# Altium schematic sheet Main.SchDoc
size A; SheetNumber: 1; SheetTotal: 4
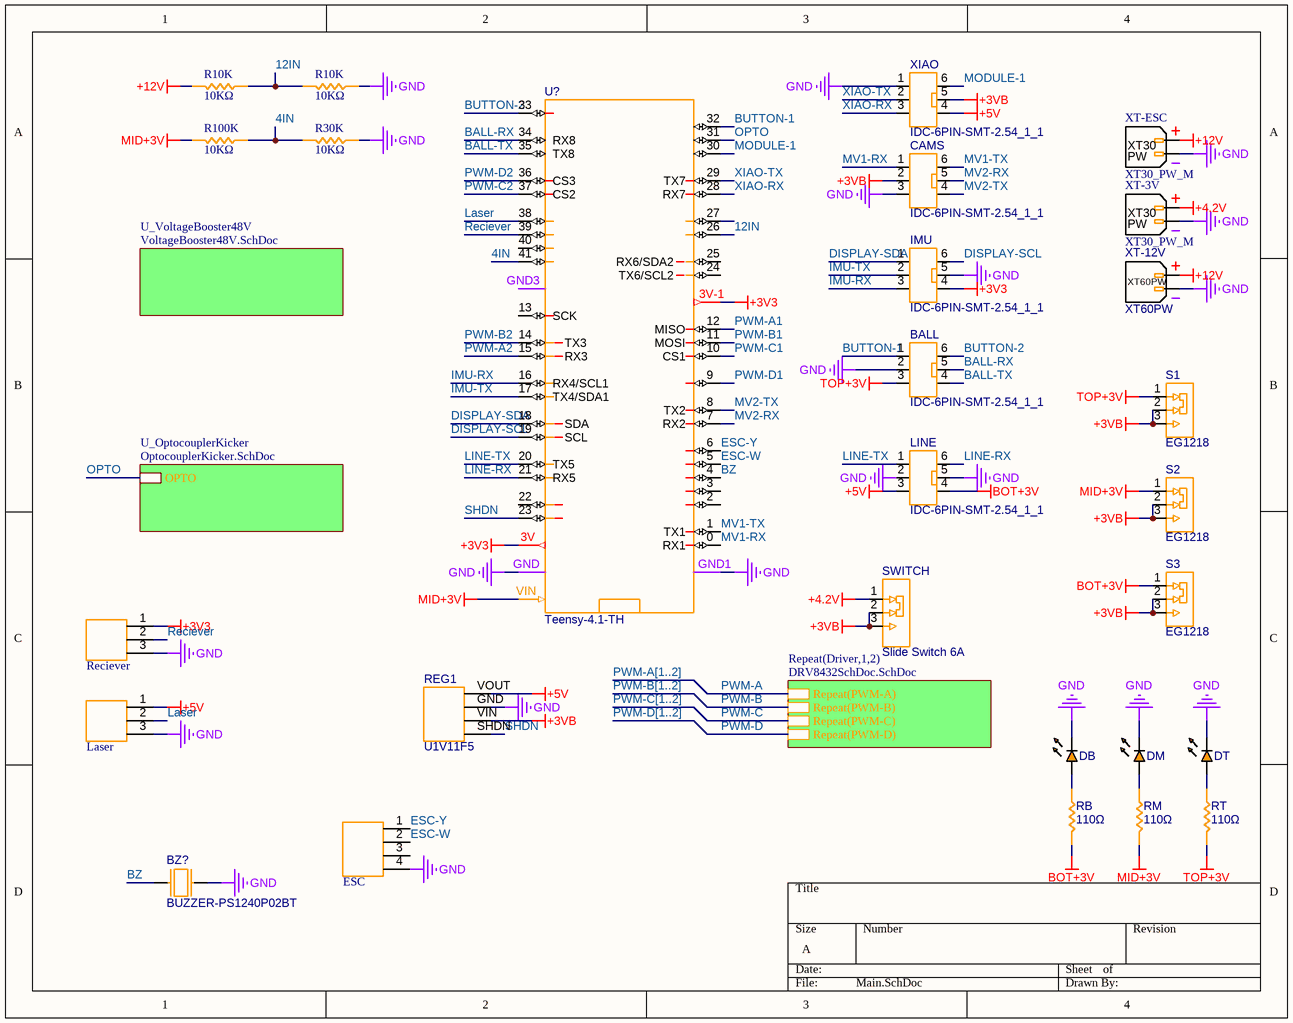
[diagram p0: Main.SchDoc]

## Parts
(Parts that share a designator on the sheet are numbered #1, #2 ... from top to bottom, then left to right.)
BALL  IDC-6PIN-SMT-2.54_1_1  [IDC-6PIN-SMT-2.54]
BZ?  BUZZER-PS1240P02BT  [BUZZER-PS1240P02BT]
CAMS  IDC-6PIN-SMT-2.54_1_1  [IDC-6PIN-SMT-2.54]
DB  LED_0603  [LED_0603]  (value not drawn)
DM  LED_0603  [LED_0603]  (value not drawn)
DT  LED_0603  [LED_0603]  (value not drawn)
ESC  4PIN  [4PIN]  (value not drawn)
IMU  IDC-6PIN-SMT-2.54_1_1  [IDC-6PIN-SMT-2.54]
Laser  3PIN  [3PIN]  (value not drawn)
LINE  IDC-6PIN-SMT-2.54_1_1  [IDC-6PIN-SMT-2.54]
R10K#1  10KΩ  [RES_0603]
R10K#2  10KΩ  [RES_0603]
R30K  10KΩ  [RES_0603]
R100K  10KΩ  [RES_0603]
RB  110Ω  [RES_0603]
Reciever  3PIN  [3PIN]  (value not drawn)
REG1  U1V11F5  [U1V11F5]
RM  110Ω  [RES_0603]
RT  110Ω  [RES_0603]
S1  EG1218  [EG1218]
S2  EG1218  [EG1218]
S3  EG1218  [EG1218]
SWITCH  Slide Switch 6A  [Slide Switch 6A]
U?  Teensy-4.1-TH  [Teensy-4.1-TH]
XIAO  IDC-6PIN-SMT-2.54_1_1  [IDC-6PIN-SMT-2.54]
XT-3V  XT30_PW_M  [XT30_PW_M]
XT-12V  XT60PW  [XT60PW]
XT-ESC  XT30_PW_M  [XT30_PW_M]

## Sub-sheets
Repeat(Driver,1,2) = DRV8432SchDoc.SchDoc: Repeat(PWM-A), Repeat(PWM-B), Repeat(PWM-C), Repeat(PWM-D)
U_OptocouplerKicker = OptocouplerKicker.SchDoc: OPTO
U_VoltageBooster48V = VoltageBooster48V.SchDoc: no entries

## Nets
+3V3: IMU.4 Reciever.1 U?.3V U?.3V-1
+3VB: CAMS.2 REG1.VIN S1.2(COM) S1.3(NO) S2.2(COM) S2.3(NO) S3.2(COM) S3.3(NO) SWITCH.2(COM) SWITCH.3(NO) XIAO.5
+4.2V: SWITCH.1(NC) XT-3V.P
+5V: Laser.1 LINE.3 REG1.VOUT XIAO.4
+12V: R10K#1.1 XT-12V.P XT-ESC.P
BOT+3V: LINE.4 RB.1 S3.1(NC)
GND: BALL.2 BZ?.2 CAMS.3 DB.C DM.C DT.C ESC.4 IMU.5 Laser.3 LINE.2 LINE.5 R10K#2.2 R30K.2 Reciever.3 REG1.GND U?.GND U?.GND1 XIAO.1 XT-3V.N XT-12V.N XT-ESC.N
MID+3V: R100K.1 RM.1 S2.1(NC) U?.VIN
TOP+3V: BALL.3 RT.1 S1.1(NC)
4IN: R30K.1 R100K.2 U?.41
12IN: R10K#1.2 R10K#2.1 U?.26
BALL-RX: BALL.5 U?.34(RX8)
BALL-TX: BALL.4 U?.35(TX8)
BUTTON-1: BALL.1 U?.32
BUTTON-2: BALL.6 U?.33
BZ: BZ?.1 U?.4
DISPLAY-SCL: IMU.6 U?.19(SCL)
DISPLAY-SDA: IMU.1 U?.18(SDA)
ESC-W: ESC.2 U?.5
ESC-Y: ESC.1 U?.6
IMU-RX: IMU.3 U?.16(RX4/SCL1)
IMU-TX: IMU.2 U?.17(TX4/SDA1)
Laser: Laser.2 U?.38
LINE-RX: LINE.6 U?.21(RX5)
LINE-TX: LINE.1 U?.20(TX5)
MODULE-1: U?.30 XIAO.6
MV1-RX: CAMS.1 U?.0(RX1)
MV1-TX: CAMS.6 U?.1(TX1)
MV2-RX: CAMS.5 U?.7(RX2)
MV2-TX: CAMS.4 U?.8(TX2)
OPTO: U?.31 ; sheet U_OptocouplerKicker/OPTO
PWM-A: sheet Repeat(Driver,1,2)/Repeat(PWM-A)
PWM-A1: U?.12(MISO)
PWM-A2: U?.15(RX3)
PWM-B: sheet Repeat(Driver,1,2)/Repeat(PWM-B)
PWM-B1: U?.11(MOSI)
PWM-B2: U?.14(TX3)
PWM-C: sheet Repeat(Driver,1,2)/Repeat(PWM-C)
PWM-C1: U?.10(CS1)
PWM-C2: U?.37(CS2)
PWM-D: sheet Repeat(Driver,1,2)/Repeat(PWM-D)
PWM-D1: U?.9
PWM-D2: U?.36(CS3)
Reciever: Reciever.2 U?.39
SHDN: REG1.SHDN U?.23
XIAO-RX: U?.28(RX7) XIAO.3
XIAO-TX: U?.29(TX7) XIAO.2
NetDB_A: DB.A RB.2
NetDM_A: DM.A RM.2
NetDT_A: DT.A RT.2

Not connected (* = marked no-connect by the designer): ESC 3(03); U? 2 3 13(SCK) 22 24(TX6/SCL2) 25(RX6/SDA2) 27 40 GND3

## Buses and harness runs
bus PWM-A[1..2]
bus PWM-B[1..2]
bus PWM-C[1..2]
bus PWM-D[1..2]

## Notes on the sheet
- (in symbol XT30_PW_M) XT30; PW

## Library data of the parts
ESC = 4PIN: 2.54 Header
Laser Reciever = 3PIN: 2.54 Header
R10K#1 R10K#2 R30K R100K RB RM RT = RES_0603: Resistor SMD 0603 generic